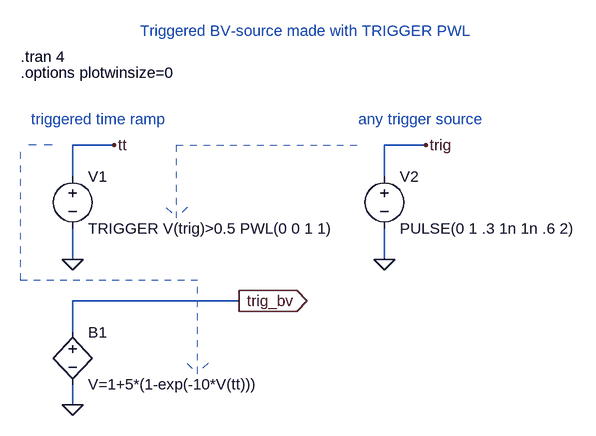
[diagram p0: schematic trigger_bv.asc]
trigger_bv.asc, the LTspice schematic file:
Version 4
SHEET 1 1312 680
WIRE -96 128 -160 128
WIRE 384 128 320 128
WIRE -160 176 -160 128
WIRE 320 176 320 128
WIRE -160 304 -160 256
WIRE 320 304 320 256
WIRE 96 368 -160 368
WIRE -160 416 -160 368
WIRE -160 528 -160 496
FLAG -160 304 0
FLAG 320 304 0
FLAG -96 128 tt
FLAG 384 128 trig
FLAG -160 528 0
FLAG 96 368 trig_bv
IOPIN 96 368 Out
SYMBOL voltage -160 160 R0
WINDOW 123 0 0 Left 0
WINDOW 39 0 0 Left 0
SYMATTR InstName V1
SYMATTR Value TRIGGER V(trig)>0.5 PWL(0 0 1 1)
SYMBOL voltage 320 160 R0
WINDOW 123 0 0 Left 0
WINDOW 39 0 0 Left 0
SYMATTR InstName V2
SYMATTR Value PULSE(0 1 .3 1n 1n .6 2)
SYMBOL bv -160 400 R0
SYMATTR InstName B1
SYMATTR Value V=1+5*(1-exp(-10*V(tt)))
TEXT -240 -8 Left 0 !.tran 4
TEXT -56 -48 Left 0 ;Triggered BV-source made with TRIGGER PWL
TEXT -240 16 Left 0 !.options plotwinsize=0
TEXT -224 88 Left 0 ;triggered time ramp
TEXT 280 88 Left 0 ;any trigger source
LINE Normal -240 336 -240 128 2
LINE Normal 32 336 -240 336 2
LINE Normal 32 480 32 336 2
LINE Normal 48 464 32 480 2
LINE Normal 48 464 48 464 2
LINE Normal 16 464 32 480 2
LINE Normal 16 464 16 464 2
LINE Normal 0 128 288 128 2
LINE Normal 0 240 0 128 2
LINE Normal -16 224 0 240 2
LINE Normal 16 224 0 240 2
LINE Normal -192 128 -240 128 2

The netlist it stands for:
* trigger_bv.asc
V1 tt 0 TRIGGER V(trig)>0.5 PWL(0 0 1 1)
V2 trig 0 PULSE(0 1 .3 1n 1n .6 2)
B1 trig_bv 0 V=1+5*(1-exp(-10*V(tt)))
.tran 4
* Triggered BV-source made with TRIGGER PWL
.options plotwinsize=0
* triggered time ramp
* any trigger source
.backanno
.end